# EAGLE design SIDEPANELV4 (EAGLE 7.6.0)
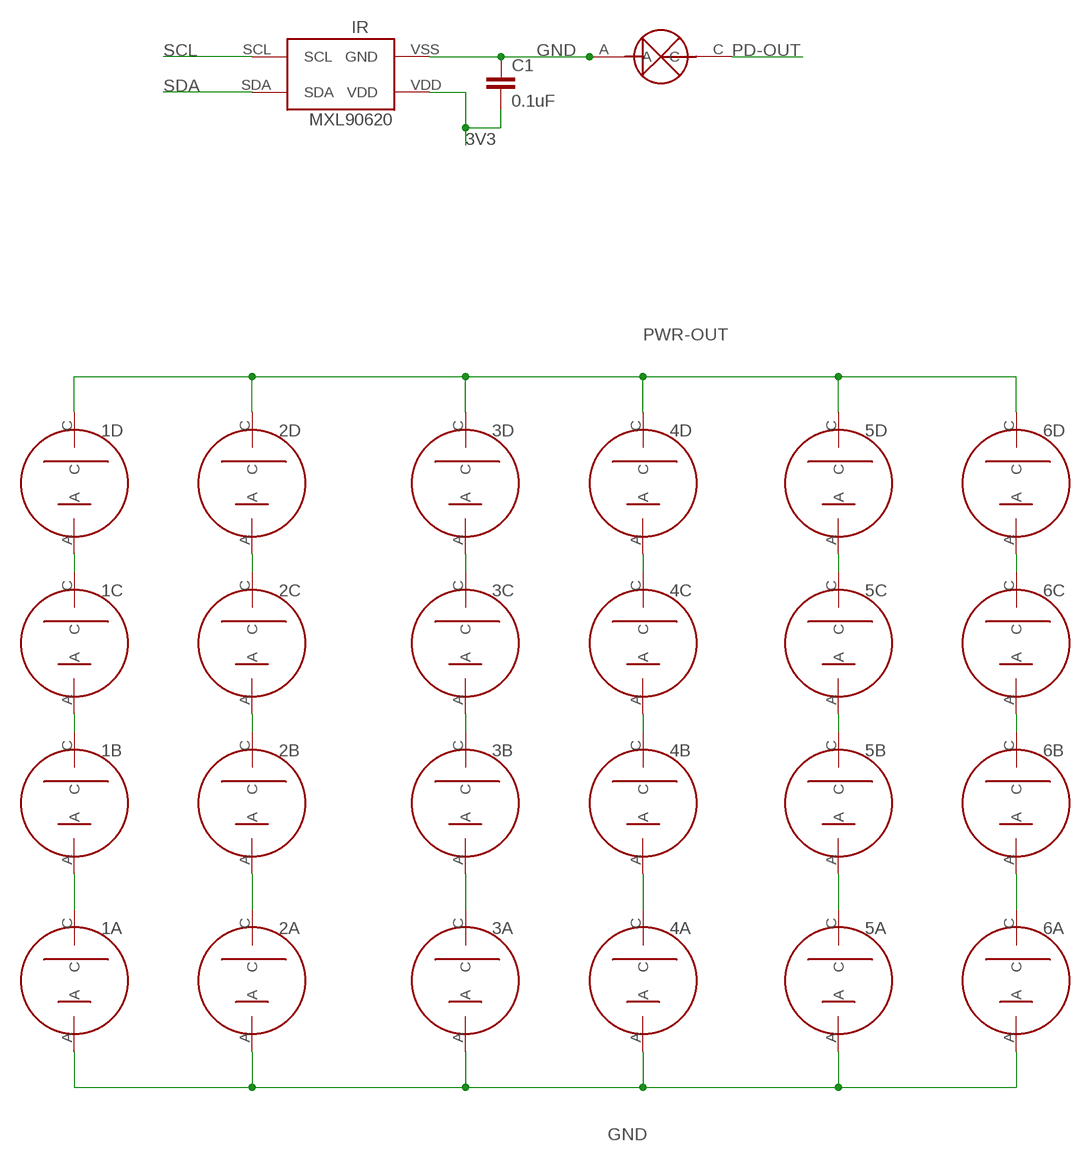
[diagram p0: schematic, sheet 1]

## Parts
1A  NEWSOLARPANEL  [SOLARCELL2]
1B  NEWSOLARPANEL  [SOLARCELL2]
1C  NEWSOLARPANEL  [SOLARCELL2]
1D  NEWSOLARPANEL  [SOLARCELL2]
2A  NEWSOLARPANEL  [SOLARCELL2]
2B  NEWSOLARPANEL  [SOLARCELL2]
2C  NEWSOLARPANEL  [SOLARCELL2]
2D  NEWSOLARPANEL  [SOLARCELL2]
3A  NEWSOLARPANEL  [SOLARCELL2]
3B  NEWSOLARPANEL  [SOLARCELL2]
3C  NEWSOLARPANEL  [SOLARCELL2]
3D  NEWSOLARPANEL  [SOLARCELL2]
4A  NEWSOLARPANEL  [SOLARCELL2]
4B  NEWSOLARPANEL  [SOLARCELL2]
4C  NEWSOLARPANEL  [SOLARCELL2]
4D  NEWSOLARPANEL  [SOLARCELL2]
5A  NEWSOLARPANEL  [SOLARCELL2]
5B  NEWSOLARPANEL  [SOLARCELL2]
5C  NEWSOLARPANEL  [SOLARCELL2]
5D  NEWSOLARPANEL  [SOLARCELL2]
6A  NEWSOLARPANEL  [SOLARCELL2]
6B  NEWSOLARPANEL  [SOLARCELL2]
6C  NEWSOLARPANEL  [SOLARCELL2]
6D  NEWSOLARPANEL  [SOLARCELL2]
C1  0.1uF  CAP0805  [0805]
IR  MXL90620  [MXL90620]
PD  PHOTODETECTOR  [PHOTODECTORDEVICE2]

## Nets
2C: 2B.C 2C.A
3V3: C1.2 IR.VDD
GND: 1A.A 2A.A 3A.A 4A.A 5A.A 6A.A C1.1 IR.VSS(GND) PD.A
N$1: 1C.C 1D.A
N$2: 2C.C 2D.A
N$3: 3C.C 3D.A
N$4: 4C.C 4D.A
N$5: 5C.C 5D.A
N$6: 6C.C 6D.A
N$7: 6B.C 6C.A
N$8: 6A.C 6B.A
N$9: 5B.C 5C.A
N$10: 5A.C 5B.A
N$11: 4A.C 4B.A
N$12: 4B.C 4C.A
N$13: 3B.C 3C.A
N$15: 1B.C 1C.A
N$16: 1A.C 1B.A
N$17: 2A.C 2B.A
N$18: 3A.C 3B.A
PD-OUT: PD.C
PWR-OUT: 1D.C 2D.C 3D.C 4D.C 5D.C 6D.C
SCL: IR.SCL
SDA: IR.SDA

## Library data of the parts
1A 1B 1C 1D 2A 2B 2C 2D 3A 3B 3C 3D 4A 4B 4C 4D 5A 5B 5C 5D 6A 6B 6C 6D = Solar Panel Parts:NEWSOLARPANEL
C1 = CNTRL_BOARD:CAP: Capacitor Standard 0603 ceramic capacitor, and 0.1" leaded capacitor.
IR = CNTRL_BOARD:MXL90620
PD = Solar Panel Parts:PHOTODETECTOR

## Board
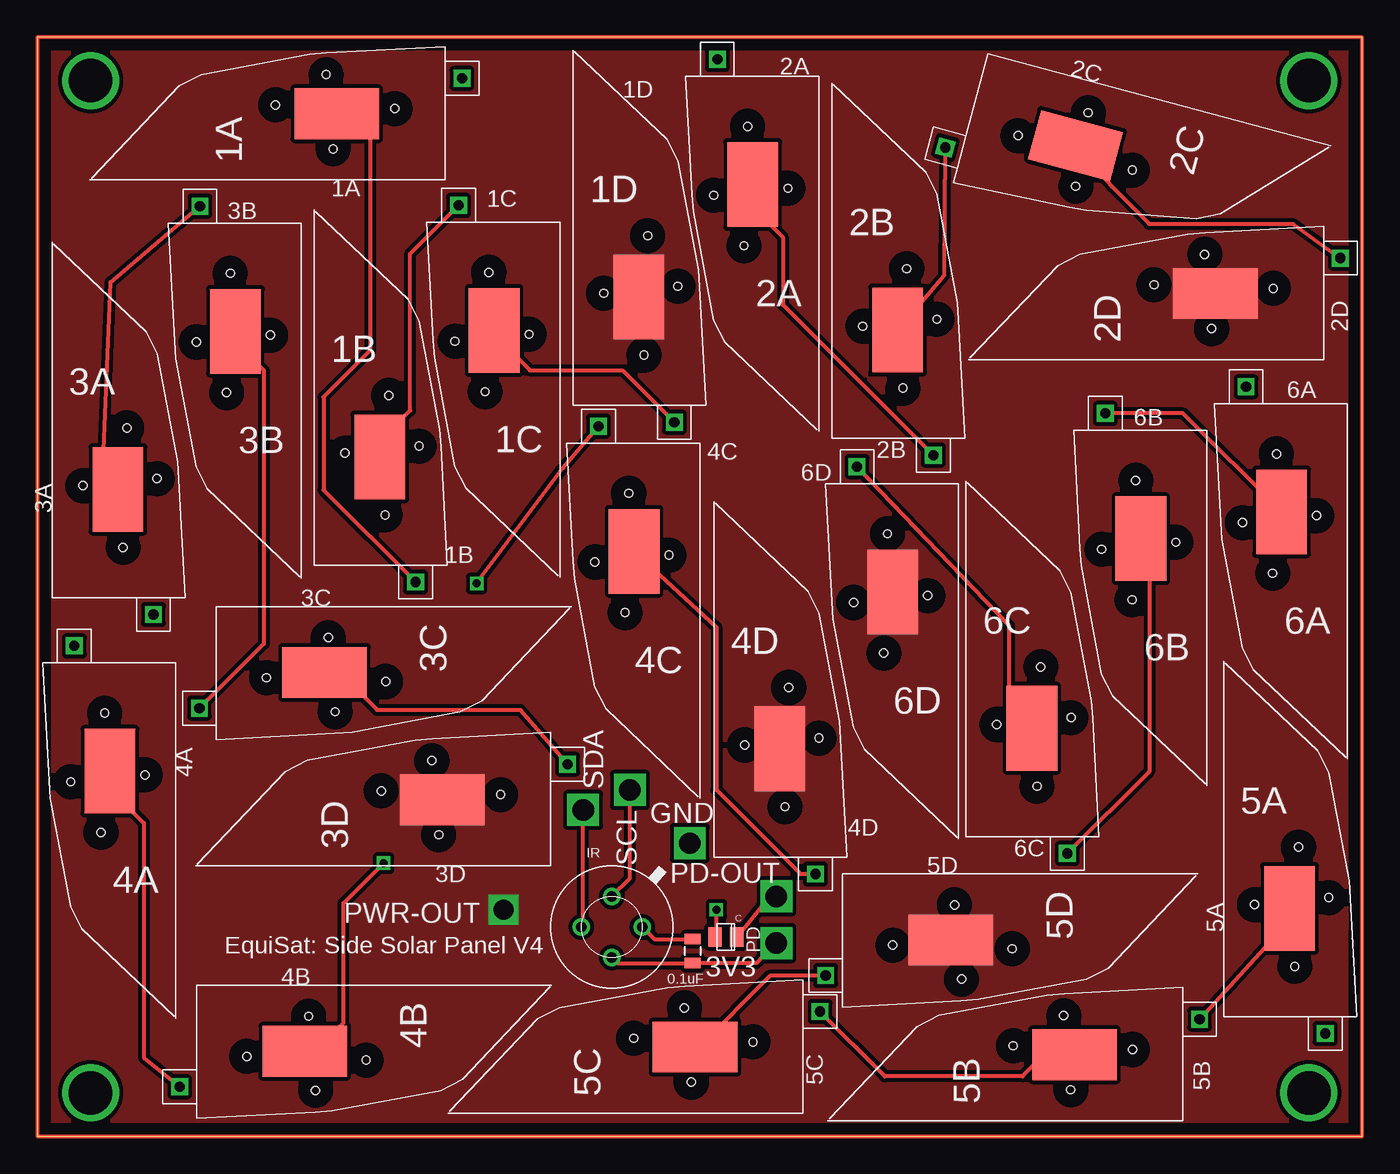
[diagram p1: board, top side]
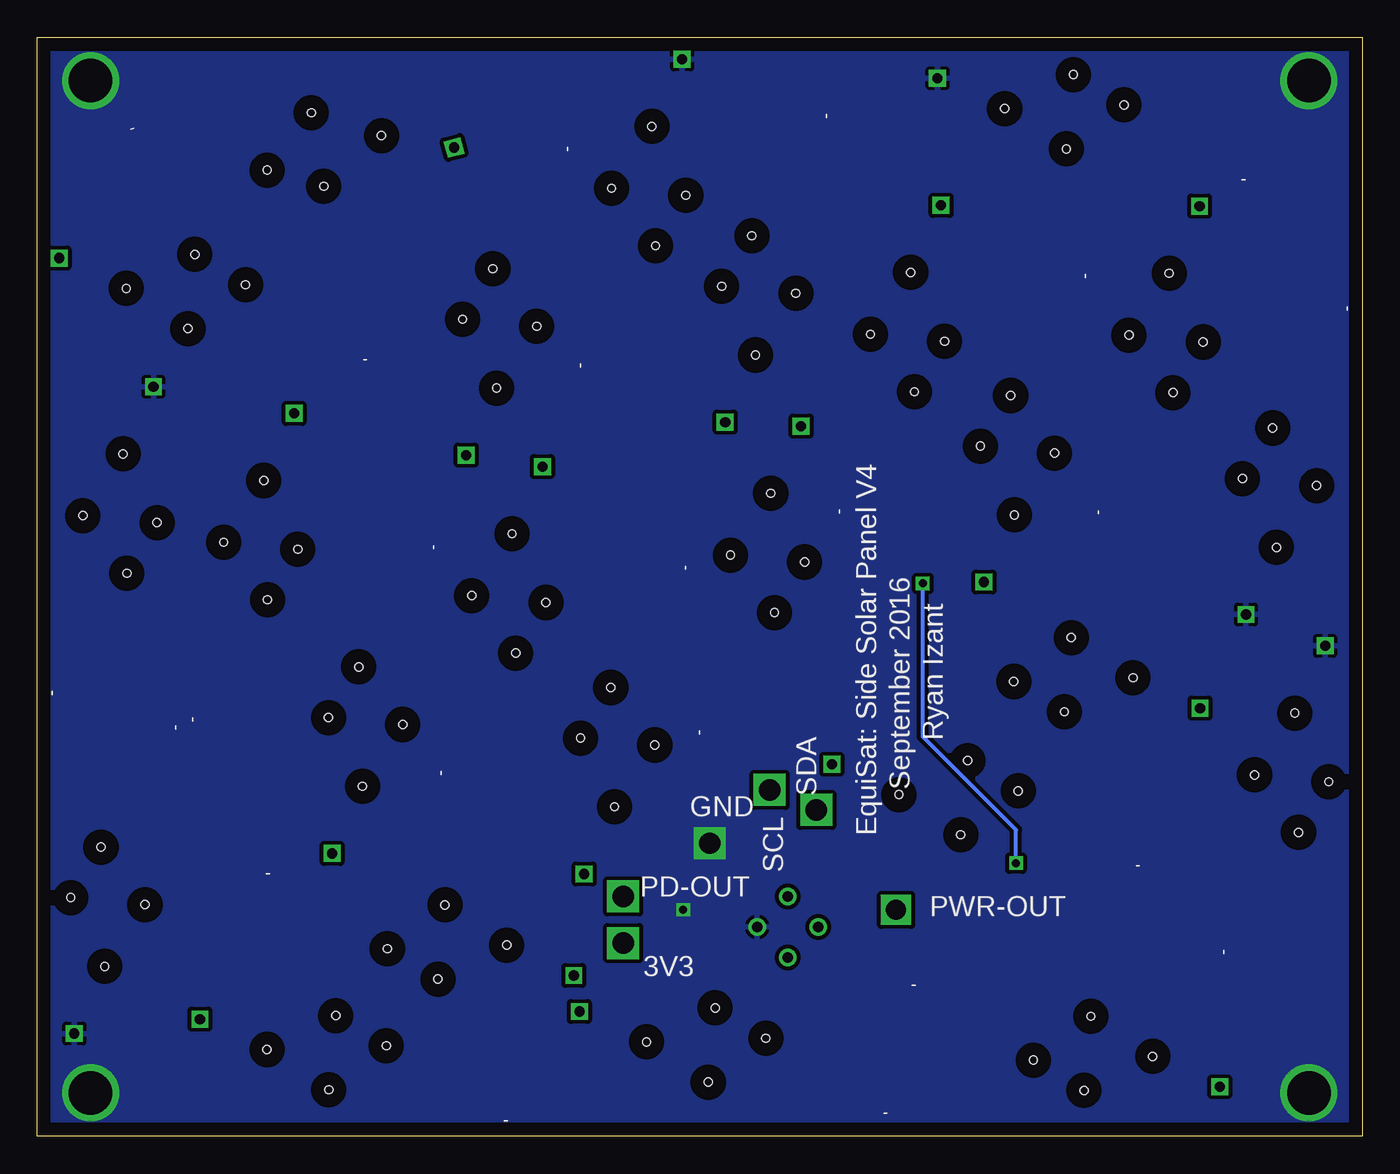
[diagram p2: board, bottom side, seen from below]

Size 99.5 x 82.5 mm. Coordinates in mm from the lower left corner, seen from the top.
Outline: 0,0 99.5,0 99.5,82.5 0,82.5 0,0
Copper layers (1*16): Top 0.035mm / dielectric 1.5mm / Bottom 0.035mm
Design rules "default": minimum track width 10mil, minimum drill 24mil, track to track 8mil, track to pad 8mil, pad to pad 8mil, via to via 8mil, smd to smd 8mil, copper to edge 40mil, drill to drill 8mil, minimum pad ring 10mil, minimum via ring 8mil, stop-mask expansion 4mil, vias tented up to drill 0mil, thermal gap 10mil

### Footprints (pad centres in the part's own frame; a part is rotated, then mirrored left to right if it is on the bottom)
SOLARCELL2 = drill 0.76 square: A 7.62,-1.27 | smd 3.81 x 6.35: C 4.953,8.128 | hole 0.6: 2.32,8.41; 5.62,12.73; 7.89,8.93; 5.34,3.77
0805 = smd 0.8 x 1.2: 1 -0.9,0; 2 0.9,0
MXL90620 = drill 0.8: SCL 2.293,0; VDD -2.293,0; VSS 0,-2.294 | drill 0.8 pad 1.2: SDA 0,2.294
PHOTODECTORDEVICE2 = smd 1 x 1.45: A 0.76,0.4; C -0.88,0.4

### Placement (x,y rotation side)
1A  30.62,71.81 90 top
1B  20.78,42.88 0 top
1C  39.25,68.62 180 top
1D  40.22,54.88 0 top
2A  58.69,79.58 180 top
2B  59.67,52.4 0 top
2C  71.4,81.26 255 top
2D  96.6,58.31 90 top
3A  1.1,40.44 0 top
3B  19.83,68.56 180 top
3C  13.44,39.76 270 top
3D  38.56,20.31 90 top
4A  10.4,35.54 180 top
4B  11.96,11.33 270 top
4C  49.76,52.04 180 top
4D  50.81,20.96 0 top
5A  89.1,8.98 0 top
5B  86.02,1.17 90 top
5C  57.52,1.74 90 top
5D  60.48,19.69 270 top
6A  98.4,55 180 top
6B  87.83,53 180 top
6C  69.74,22.5 0 top
6D  69.19,49 180 top
C1  49.22,13.9 270 top
IR  43.14,15.71 90 top
PD  51.65,15.35 180 top

### Tracks (layer width: path | path; a pad name or v marks a point on that pad's centre or on a via)
2C
  Top 0.305: 2B.C 68.12,64.63 2C.A
3V3  (via drill 1.6)
  Top 0.305: IR.VDD 43.56,13 C1.2 54,13 54.5,13.5 v55.5,14.5
GND  (via drill 0.6, 1.6, 3.26)
  Top 0.305: IR.VSS 46.34,14.8 C1.1 49.37,14.95 | PD.A 51,15.06 v51,17
  other vias: 49,22 4,79.25 4,3.25 95.5,3.25 95.5,79.25
  pour Bottom (isolate 0.305): -5.85,99.18 120.54,99.18 129.54,-7.62 -6.35,-7.62
N$1
  Top 0.305: 1C.C 34.3,60.2 37,57.5 43.95,57.5 1D.A
N$2
  Top 0.305: 2C.C 80.69,71.31 83.5,68.5 94.3,68.5 2D.A
N$3
  Top 0.305: 3C.C 22.69,34.81 25.5,32 36.26,32 3D.A
N$4
  Top 0.305: 4C.C 51,38.22 51,26 57.31,19.69 4D.A
N$5
  Top 0.305: 5C.C 49.69,6.69 55.07,12.07 5D.A
N$6
  Top 0.305: 6C.C 74.69,31.31 73,33 73,38.34 6D.A
N$7
  Top 0.305: 6B.C 83.5,43.75 83.5,27.37 6C.A
N$8
  Top 0.305: 6A.C 86.05,54.27 6B.A
N$9
  Top 0.305: 5B.C 76.12,6.62 74,4.5 63.65,4.5 5C.A
N$10
  Top 0.305: 5A.C 92.55,17.05 92.55,14.55 5B.A
N$11
  Top 0.305: 4A.C 5.95,25.55 8,23.5 8,5.9 4B.A
N$12  (via drill 0.6)
  Top 0.305: 4B.C 20.38,5.88 23,8.5 23,17.5 v26,20.5 | v33,41.5 39.5,50.17 4C.A
  Bottom 0.305: v26,20.5 26,23 33,30 v33,41.5
N$13
  Top 0.305: 3B.C 15.38,59.12 17,57.5 17,36.97 3C.A
N$14
  Top 0.305: 0,82.5 0,0 99.5,0 99.5,82.5 0,82.5
N$15
  Top 0.305: 1B.C 25.73,52.23 28,54.5 28,66.26 1C.A
N$16
  Top 0.305: 1A.C 23.24,76.76 25,75 25,59 21.5,55.5 21.5,48.51 1B.A
N$17
  Top 0.305: 2A.C 53.74,69.76 56,67.5 56,62.42 2B.A
N$18
  Top 0.305: 3A.C 7.55,49.95 5,51.5 5.5,64.12 3B.A
PD-OUT  (via drill 1.6)
  Top 0.305: v55.5,18 55.03,18.03 PD.C
PWR-OUT  (via drill 1.5)
  other vias: 35,17
  pour Top (isolate 0.305, no thermals): -7.62,107.95 132.08,107.95 132.08,-10.16 -7.62,-10.16
SCL  (via drill 1.6)
  Top 0.305: IR.SCL 44.5,19.36 v44.5,26
SDA  (via drill 1.6)
  Top 0.305: IR.SDA 41,15.86 v41,24.5

### Text on the board
tPlace: SDA | SCL | GND | PD-OUT | PWR-OUT | EquiSat: Side Solar Panel V4 | 3V3
bPlace: EquiSat: Side Solar Panel V4 | September 2016 | Ryan Izant | SDA | SCL | GND | PD-OUT | PWR-OUT | 3V3